# Altium schematic sheet HIGROTERM.SchDoc
size A4
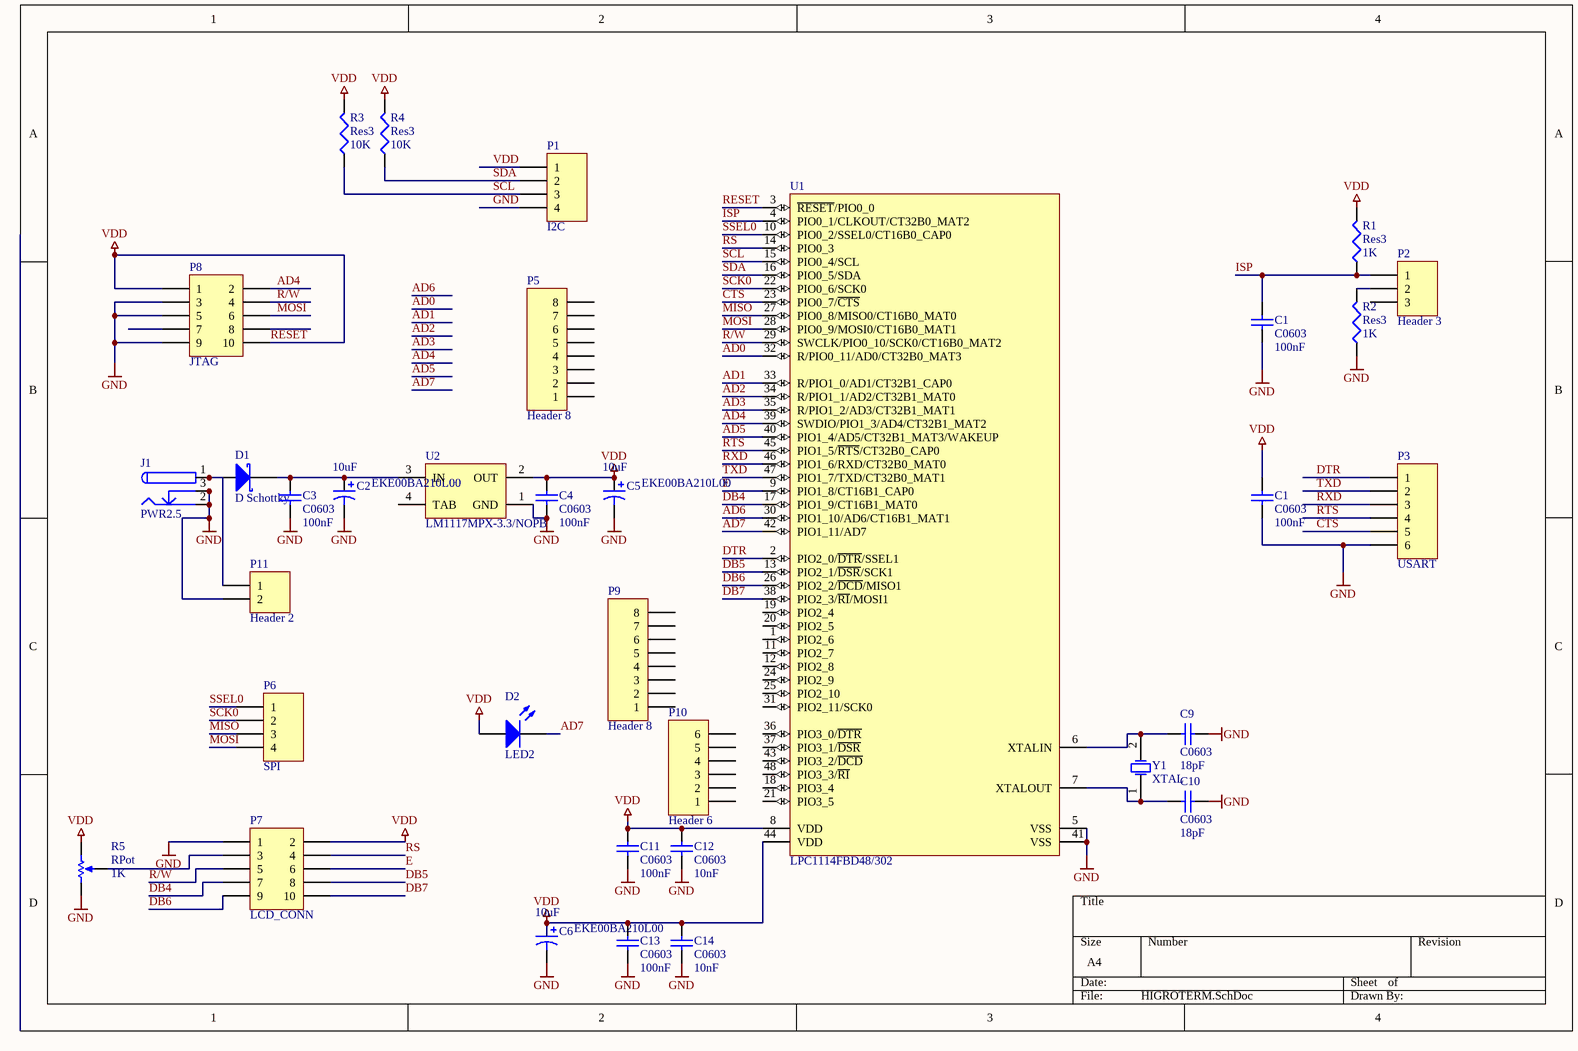
[diagram p0: HIGROTERM.SchDoc]

## Parts
(Parts that share a designator on the sheet are numbered #1, #2 ... from top to bottom, then left to right.)
C1#1  C0603  value 100nF  [0603]
C1#2  C0603  value 100nF  [0603]
C2  EKE00BA210L00  value 10uF  [PANASONIC-C-CAP]
C3  C0603  value 100nF  [0603]
C4  C0603  value 100nF  [0603]
C5  EKE00BA210L00  value 10uF  [PANASONIC-C-CAP]
C6  EKE00BA210L00  value 10uF  [PANASONIC-C-CAP]
C9  C0603  value 18pF  [0603]
C10  C0603  value 18pF  [0603]
C11  C0603  value 100nF  [0603]
C12  C0603  value 10nF  [0603]
C13  C0603  value 100nF  [0603]
C14  C0603  value 10nF  [0603]
D1  D Schottky  [SMB]
D2  LED2  [3.2X1.6X1.1]
J1  PWR2.5  [KLD-0202]
P1  I2C  [HDR1X4]
P2  Header 3  [HDR1X3]
P3  USART  [HDR1X6]
P5  Header 8  [HDR1X8]
P6  SPI  [HDR1X4]
P7  LCD_CONN  [HDR2X5H]
P8  JTAG  [HDR2X5H]
P9  Header 8  [HDR1X8]
P10  Header 6  [HDR1X6]
P11  Header 2  [HDR1X2]
R1  Res3  value 1K  [J1-0603]
R2  Res3  value 1K  [J1-0603]
R3  Res3  value 10K  [J1-0603]
R4  Res3  value 10K  [J1-0603]
R5  RPot  value 1K  [VR5]
U1  LPC1114FBD48/302  [SOT313-2_V]
U2  LM1117MPX-3.3/NOPB  [MP04A_N]
Y1  XTAL  [XTAL-HC497]

## Nets
GND: C1#1.2 C1#2.2 C2.2 C3.1 C4.1 C5.2 C6.2 C9.1 C10.1 C11.1 C12.1 C13.1 C14.1 J1.2 J1.2A J1.2B J1.3 J1.3A J1.3B P1.4 P3.6 P7.1 P8.3 P8.5 P8.9 P11.2 R2.1 R5.1(TOP) U1.5(VSS) U1.41(VSS) U2.1(GND)
RESET: C1#2.1 C4.2 C5.1 C6.1 C11.2 C12.2 C13.2 C14.2 D2.1(A) P1.1 P7.2 P8.1 P8.10 R1.2 R3.2 R4.2 R5.2(BOT) U1.3(~{RESET}/PIO0_0) U1.8(VDD) U1.44(VDD) U2.2(OUT)  [also labelled VDD]
AD0: U1.32(R/PIO0_11/AD0/CT32B0_MAT3)
AD1: U1.33(R/PIO1_0/AD1/CT32B1_CAP0)
AD2: U1.34(R/PIO1_1/AD2/CT32B1_MAT0)
AD3: U1.35(R/PIO1_2/AD3/CT32B1_MAT1)
AD4: P8.2 U1.39(SWDIO/PIO1_3/AD4/CT32B1_MAT2)
AD5: U1.40(PIO1_4/AD5/CT32B1_MAT3/WAKEUP)
AD6: U1.30(PIO1_10/AD6/CT16B1_MAT1)
AD7: D2.2(K) U1.42(PIO1_11/AD7)
CTS: P3.5 U1.23(PIO0_7/~{CTS})
DB4: P7.7 U1.17(PIO1_9/CT16B1_MAT0)
DB5: P7.8 U1.13(PIO2_1/~{DSR}/SCK1)
DB6: P7.9 U1.26(PIO2_2/~{DCD}/MISO1)
DB7: P7.10 U1.38(PIO2_3/~{RI}/MOSI1)
DTR: P3.1 U1.2(PIO2_0/~{DTR}/SSEL1)
E: P7.6 U1.9(PIO1_8/CT16B1_CAP0)
ISP: C1#1.1 P2.1 R1.1 U1.4(PIO0_1/CLKOUT/CT32B0_MAT2)
MISO: P6.3 U1.27(PIO0_8/MISO0/CT16B0_MAT0)
MOSI: P6.4 P8.6 U1.28(PIO0_9/MOSI0/CT16B0_MAT1)
R/W: P7.5 P8.4 U1.29(SWCLK/PIO0_10/SCK0/CT16B0_MAT2)
RS: P7.4 U1.14(PIO0_3)
RTS: P3.4 U1.45(PIO1_5/~{RTS}/CT32B0_CAP0)
RXD: P3.3 U1.46(PIO1_6/RXD/CT32B0_MAT0)
SCK0: P6.2 U1.22(PIO0_6/SCK0)
SCL: P1.3 R3.1 U1.15(PIO0_4/SCL)
SDA: P1.2 R4.1 U1.16(PIO0_5/SDA)
SSEL0: P6.1 U1.10(PIO0_2/SSEL0/CT16B0_CAP0)
TXD: P3.2 U1.47(PIO1_7/TXD/CT32B0_MAT1)
NetC2_1: C2.1 C3.2 D1.2(K) U2.3(IN)
NetC9_2: C9.2 U1.6(XTALIN) Y1.2(OSC2)
NetC10_2: C10.2 U1.7(XTALOUT) Y1.1(OSC1)
NetD1_1: D1.1(A) J1.1 J1.1A J1.1B P11.1
NetP2_2: P2.2 R2.2
NetP7_3: P7.3 R5.3(TAP)

Not connected (* = marked no-connect by the designer): P2 3; P5 1 2 3 4 5 6 7 8; P8 7 8; P9 1 2 3 4 5 6 7 8; P10 1 2 3 4 5 6; U1 1(PIO2_6) 11(PIO2_7) 12(PIO2_8) 18(PIO3_4) 19(PIO2_4) 20(PIO2_5) 21(PIO3_5) 24(PIO2_9) 25(PIO2_10) 31(PIO2_11/SCK0) 36(PIO3_0/~{DTR}) 37(PIO3_1/~{DSR}) 43(PIO3_2/~{DCD}) 48(PIO3_3/~{RI}); U2 4(TAB)

## Library data of the parts
C1#1 C1#2 C3 C4 C9-C14 = C0603: Ceramic Chip Capacitor - Standard; Note: Footprint corresponds to dimensions for bulk cassette packaging. This case size has tightened tolerances.; Published: 17-Jul-2002; LatestRevisionDate: 19-Mar-2004; LatestRevisionNote: Silkscreen size reduced.; DatasheetDocument: Mar-2001; PackageDocument: Mar-2001; PackageReference: 0603; Publisher: Altium Limited; Code_JEITA: 0603; Code_IPC: 1608 [0603]; ComponentLink1Description: Manufacturer Link; ComponentLink1URL: http://www.kemet.com/; ComponentLink2Description: Datasheet; ComponentLink2URL: http://www.kemet.com/kemet/web/homepage/kechome.nsf/vapubfilesname/F3102TA.pdf/$file/F3102TA.pdf
C2 C5 C6 = EKE00BA210L00: Aluminum Electrolytic Capacitor, Radial Style with Long Leads: 10uF, 100V; Note: Refer to Manufacturer's Data Sheets for other lead formations; DrillSize: Nominal, Rounded To The Nearest 0.1mm; Published: 19-Mar-2004; DatasheetDocument: 30-May-2000; PackageReference: CAPPR2.5-6.3X11; Publisher: Altium Limited; ComponentLink1Description: Manufacturer Link; ComponentLink1URL: http://www.vishay.com/; ComponentLink2Description: Datasheet; ComponentLink2URL: http://www.vishay.com/docs/25008/eke.pdf
D1 = D Schottky: Schottky Diode; Published: 8-Jun-2000; LatestRevisionDate: 17-Jul-2002; LatestRevisionNote: Re-released for DXP Platform.; PackageReference: SMB; Publisher: Altium Limited; PackageDescription: DO-214-AA/SMB; 2 C-Bend Leads; Body 5.3 x 3.6 mm, inc. leads (LxW); Code_JEDEC: DO-214-AA
D2 = LED2: Typical RED, GREEN, YELLOW, AMBER GaAs LED; Published: 8-Jun-2000; LatestRevisionDate: 17-Jul-2002; LatestRevisionNote: Re-released for DXP Platform.; PackageVersion: Feb-2002; PackageReference: 3.2X1.6X1.1; Publisher: Altium Limited; PackageDescription: SM LED; 2 Flat Leads
J1 = PWR2.5: Low Voltage Power Supply Connector; Published: 17-Dec-2003; DatasheetDocument: 09-May-2002; Publisher: Altium Limited; ComponentLink1Description: Manufacturer Link; ComponentLink1URL: http://domino.kycon.com/internet/Products.html
P1 P6 = Header 4: Header, 4-Pin; LatestRevisionDate: 17-Jul-2002; LatestRevisionNote: Re-released for DXP Platform.; Publisher: Altium Limited
P2 = Header 3: Header, 3-Pin; LatestRevisionDate: 17-Jul-2002; LatestRevisionNote: Re-released for DXP Platform.; Publisher: Altium Limited
P3 P10 = Header 6: Header, 6-Pin; LatestRevisionDate: 17-Jul-2002; LatestRevisionNote: Re-released for DXP Platform.; Publisher: Altium Limited
P5 P9 = Header 8: Header, 8-Pin; LatestRevisionDate: 17-Jul-2002; LatestRevisionNote: Re-released for DXP Platform.; Publisher: Altium Limited
P7 P8 = Header 5X2H: Header, 5-Pin, Dual row, Right Angle; LatestRevisionDate: 17-Jul-2002; LatestRevisionNote: Re-released for DXP Platform.; Publisher: Altium Limited
P11 = Header 2: Header, 2-Pin; LatestRevisionDate: 17-Jul-2002; LatestRevisionNote: Re-released for DXP Platform.; Publisher: Altium Limited
R1-R4 = Res3: Resistor; Published: 8-Jun-2000; LatestRevisionDate: 29-May-2009; LatestRevisionNote: IPC-7351 Footprint Added.; PackageReference: J1-0603; Publisher: Altium Limited; PackageDescription: Chip Resistor
R5 = RPot: Potentiometer; Sim Note: Enter the Resistance value and the set point into parameter fields.; Set Position: 0.5; Published: 8-Jun-2000; LatestRevisionDate: 17-Jul-2002; LatestRevisionNote: Re-released for DXP Platform.; PackageReference: VR5; Publisher: Altium Limited; PackageDescription: Variable Resistor, Thru-Hole; 3 Leads
U1 = LPC1114FBD48/302: 32-bit ARM Cortex-M0 MCU, LPC1100L Series, 32 kB Flash, 8 kB SRAM, 2 SPI, ADC, 48-Pin LQFP; fmax: 50 MHz; SRAM: 8 kB; Flash: 32 kB; GPIOs: 42; UART: 1; SPI: 2; PLL: Y; Timers: 4; ADC channels: 8; VDD (min): 1.8 V; VDD (typ): 3.3 V; VDD (max): 3.6 V; Code_IEC: 136E05; DatasheetVersion: Rev. 7.1, Apr-2012; PackageVersion: Feb-2003; PackageReference: SOT313-2; PackageDescription: LQFP48: Plastic Low Profile Quad Flat Package; 48 Leads; Body 7 x 7 x 1.4 mm; I2C: 1; Code_JEDEC: MS-026; ComponentLink1Description: Manufacturer URL; ComponentLink1URL: http://www.nxp.com/; ComponentLink2Description: Datasheet; ComponentLink2URL: http://www.nxp.com/documents/data_sheet/LPC111X.pdf
U2 = LM1117MPX-3.3/NOPB: 800mA Low-Dropout Linear Regulator, 4-pin SOT-223, Pb-Free; Manufacturer: National Semiconductor; PackageTopMarking: XYTT*N05A; PowerWise: N; CompType: LDO IC; High-Reliability: Y; DatasheetVersion: Apr-2006; PackageVersion: revB, Apr-2003; PackageReference: MP04A; PackageDescription: Molded SOT-223, 6.50 x 3.56 x 1.6mm Body, 4 Lead, 2.3mm Pitch; PartNumber: LM1117MPX-3.3/NOPB; RoHS: Y; PinCount: 4; Code_JEDEC: TO-261-AA; Code_IPC: SOT223-4; ComponentLink1Description: Manufacturer URL; ComponentLink1URL: http://www.national.com/; ComponentLink2Description: LM1117 Datasheet; ComponentLink2URL: http://www.national.com/ds/LM/LM1117.pdf; ComponentLink3Description: LM1117 Web Page; ComponentLink3URL: http://www.national.com/pf/LM/LM1117.html; ComponentLink4Description: MP04A Package Page; ComponentLink4URL: http://www.national.com/packaging/folders/mp04a.html
Y1 = XTAL: Crystal Oscillator; Published: 8-Jun-2000; LatestRevisionDate: 17-Jul-2002; LatestRevisionNote: Re-released for DXP Platform.; PackageReference: R38; Publisher: Altium Limited; PackageDescription: Crystal, Thru-Hole; 2 Leads; Body 3.1 x 8.2 mm (Dia.xH)